# EAGLE board v.0.0.0 (EAGLE 5.08)
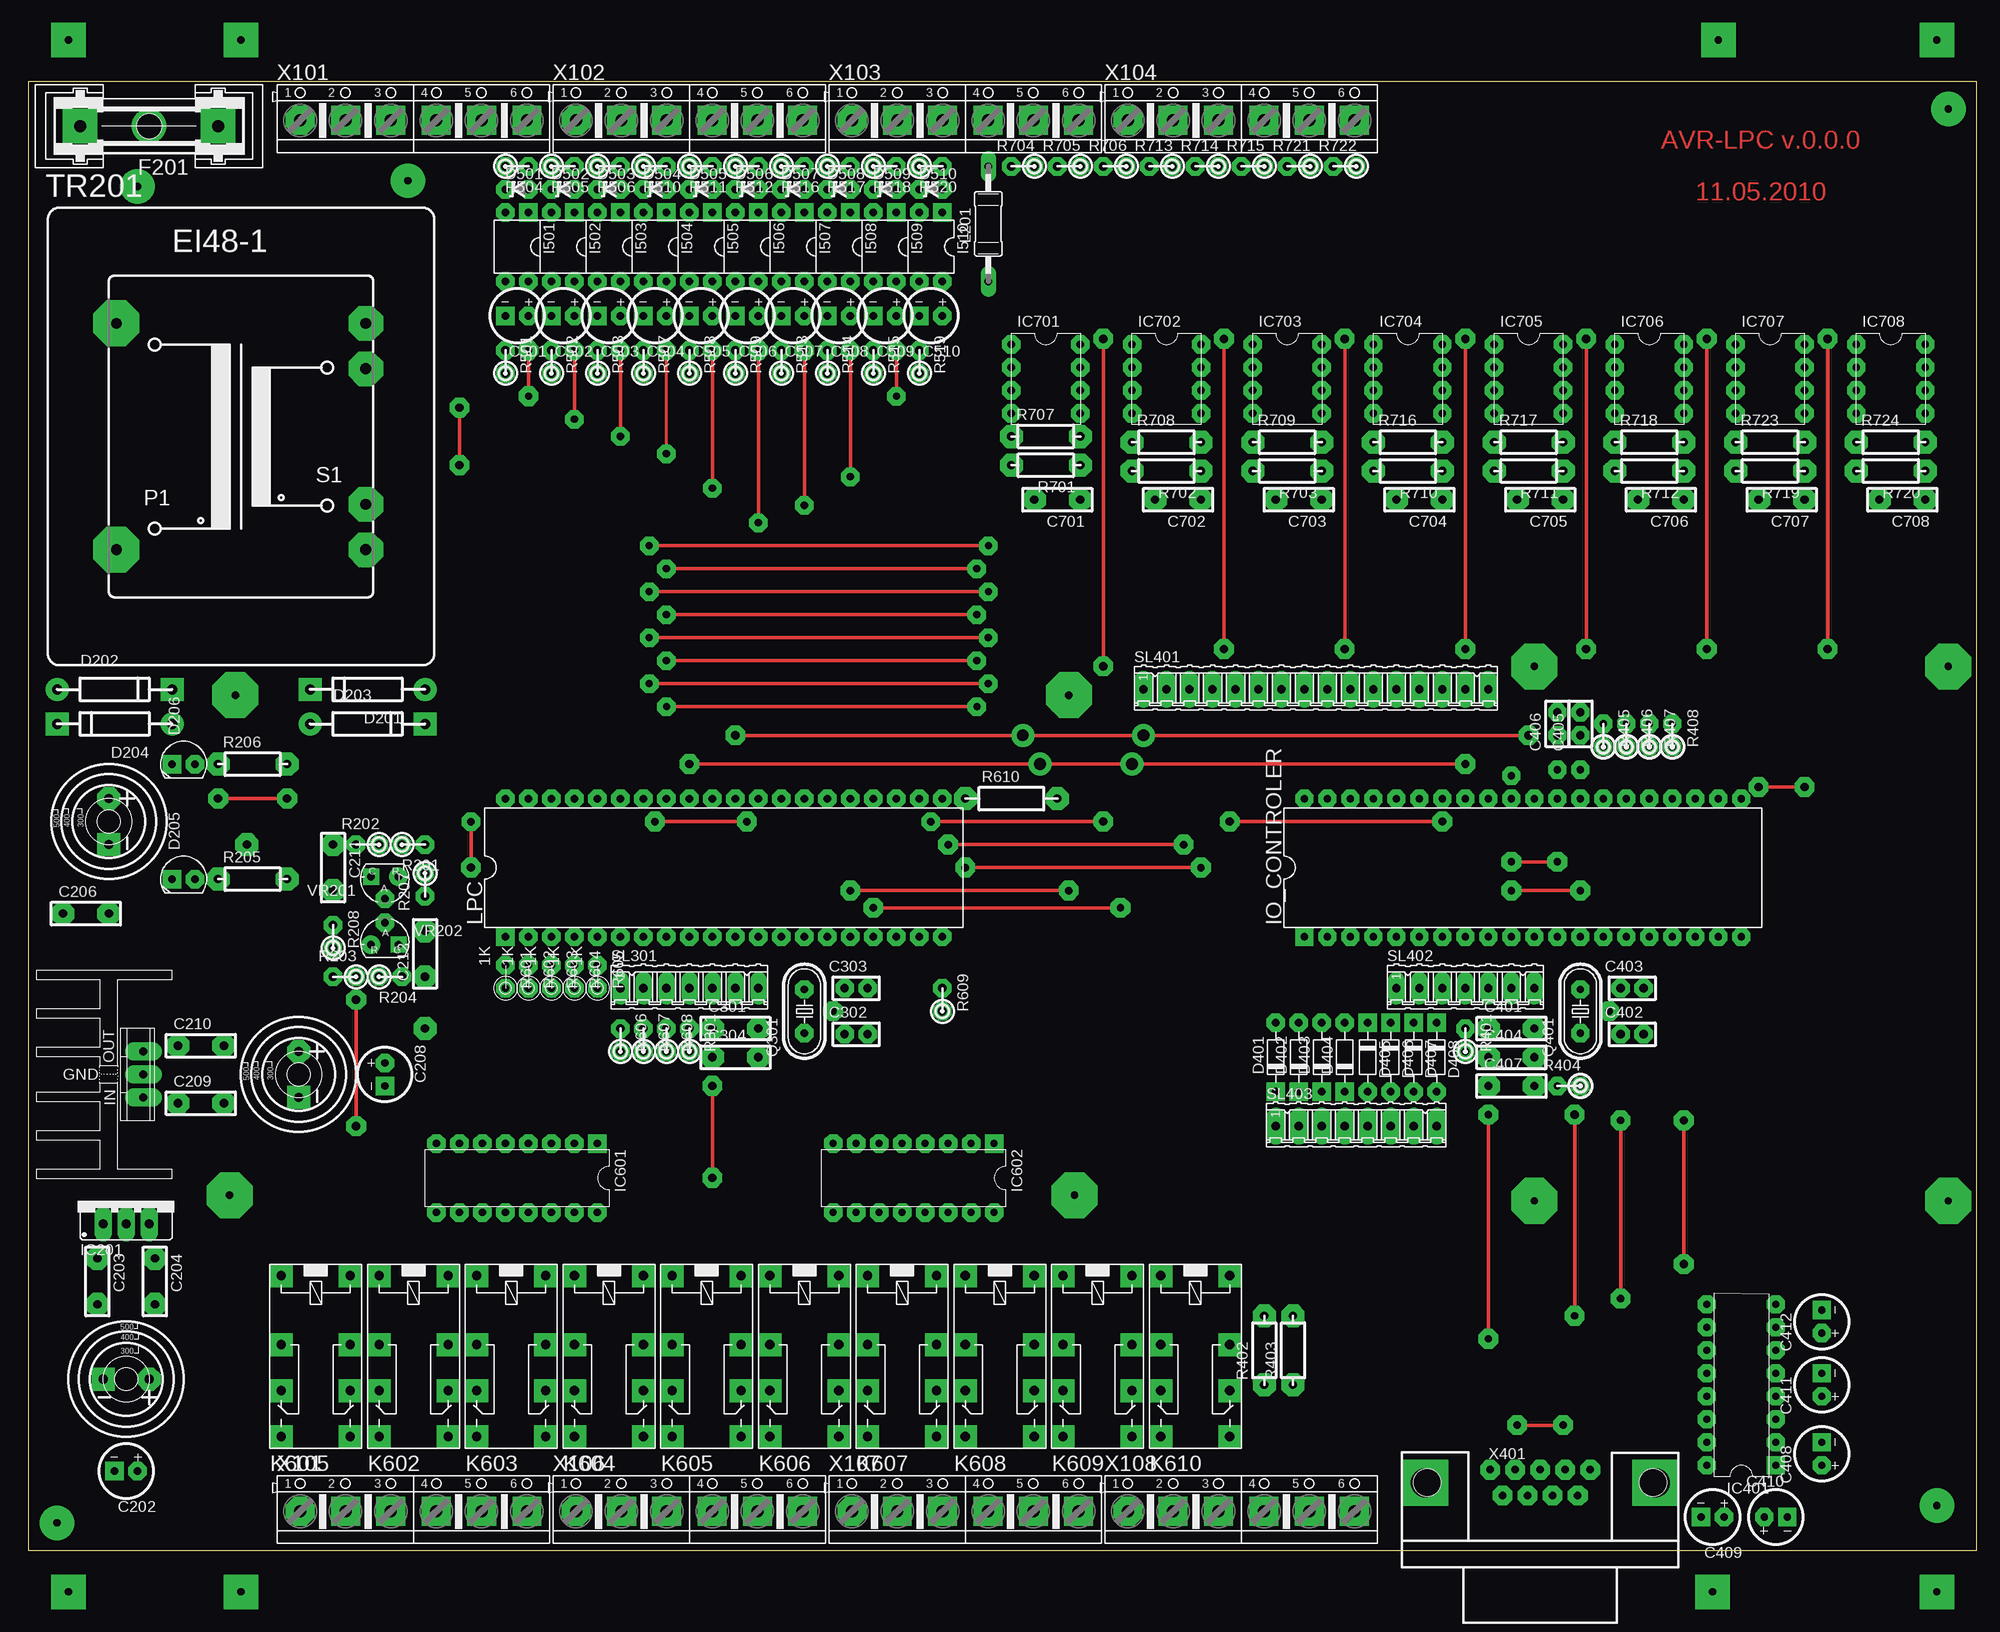
[diagram p7: board, top side]
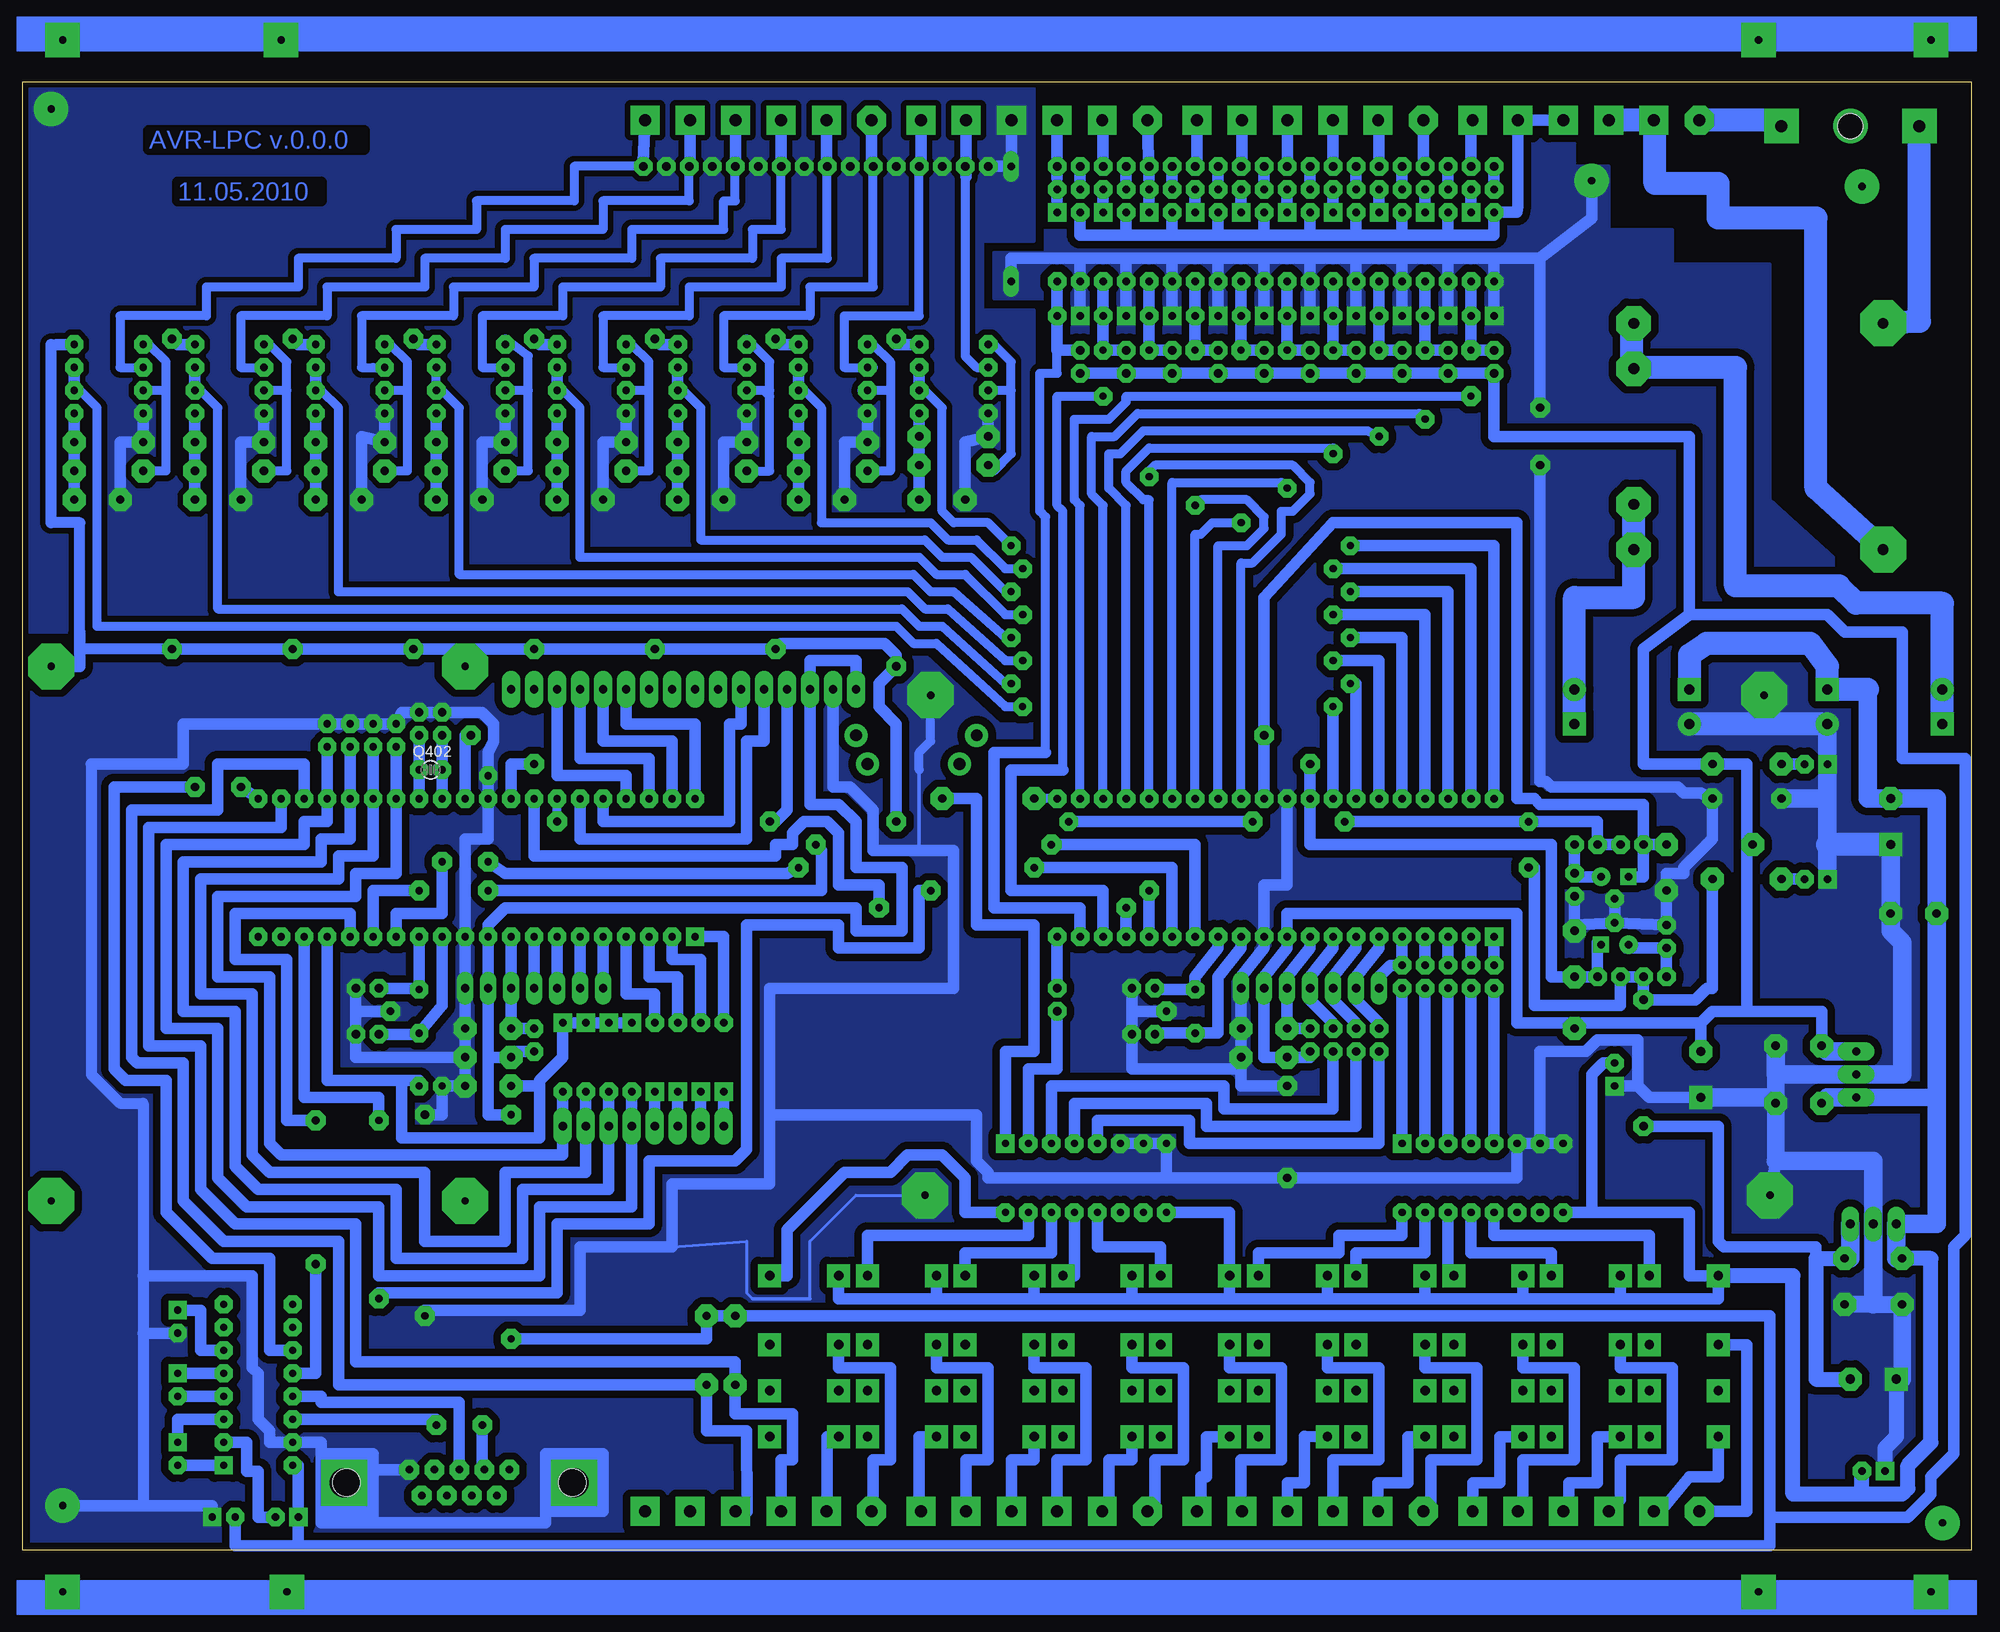
[diagram p8: board, bottom side, seen from below]

Size 215.25 x 162.23 mm. Coordinates in mm from the lower left corner, seen from the top.
Outline: 0,0 215.25,0 215.25,162.23 0,162.23 0,0
Copper layers (1*16): Top 0.035mm / dielectric 1.5mm / Bottom 0.035mm
Design rules "default *": minimum track width 50mil, minimum drill 31mil, track to track 25mil, track to pad 20mil, pad to pad 20mil, via to via 20mil, smd to smd 8mil, copper to edge 25mil, drill to drill 25mil, minimum pad ring 18mil, minimum via ring 8mil, stop-mask expansion 4mil, vias tented up to drill 0mil, thermal gap 10mil
bKeepout: 10 lines

## Footprints (pad centres in the part's own frame; a part is rotated, then mirrored left to right if it is on the bottom)
CP200X100X40 = drill 1.016 pad 2.54 octagon: + 2.54,0 | drill 1.016 pad 2.54 square: - -2.54,0
CP100X80X32 = drill 0.813 pad 2.032 octagon: + -1.27,0 | drill 0.813 pad 2.032 square: - 1.27,0
C200X100X36 = drill 0.914 pad 2.54 octagon: P$1 -2.54,0; P$2 2.54,0
C100X86X36 = drill 0.914 pad 2.032 octagon: P$1 -1.27,0; P$2 1.27,0
400X100 = drill 1.1 pad 2.54 round: A -6.35,0 | drill 1.1 pad 2.54 square: C 6.35,0
SFH205 = drill 0.813 pad 2.032 octagon: A 0,-1.27 | drill 0.813 pad 2.032 square: K 0,1.27
D-7.5 = drill 0.813 pad 2.032 octagon: A 3.81,0 | drill 0.813 pad 2.032 square: C -3.81,0
ZDIO-2.5 = drill 0.813 pad 2.032 octagon: A 1.27,0; C -1.27,0
GSH15 = drill 1.321 pad 3.81 square: 1 -7.62,0; 2 7.62,0 | drill 2 pad 3.81 round: P$1 0,0 | hole 2.794: 0,0
DIL04 = drill 0.813 pad 2.032 square: 1 -1.27,-3.81 | drill 0.813 pad 2.032 octagon: 2 1.27,-3.81; 3 1.27,3.81; 4 -1.27,3.81
78XXS = drill 1.016 long: GND 0,-2.54; IN -2.54,-2.54; OUT 2.54,-2.54
78XX_VERTICAL_COOLER = drill 0.9 pad 2.032 long: GND 0,-2.54; IN -2.54,-2.54; OUT 2.54,-2.54
DIL16 = drill 0.8 pad 2.032 square: 1 -8.89,-3.81 | drill 0.8 pad 2.032 octagon: 2 -6.35,-3.81; 3 -3.81,-3.81; 4 -1.27,-3.81; 5 1.27,-3.81; 6 3.81,-3.81; 7 6.35,-3.81; 8 8.89,-3.81; 9 8.89,3.81; 10 6.35,3.81; 11 3.81,3.81; 12 1.27,3.81; 13 -1.27,3.81; 14 -3.81,3.81; 15 -6.35,3.81; 16 -8.89,3.81
DIL8 = drill 0.8 pad 2.032 octagon: 1 -3.81,-3.81; 2 -1.27,-3.81; 3 1.27,-3.81; 4 3.81,-3.81; 5 3.81,3.81; 6 1.27,3.81; 7 -1.27,3.81; 8 -3.81,3.81
DIL40 = drill 0.813 pad 2.032 square: 1 -24.13,-7.62 | drill 0.813 pad 2.032 octagon: 2 -21.59,-7.62; 3 -19.05,-7.62; 4 -16.51,-7.62; 5 -13.97,-7.62; 6 -11.43,-7.62; 7 -8.89,-7.62; 8 -6.35,-7.62; 9 -3.81,-7.62; 10 -1.27,-7.62; 11 1.27,-7.62; 12 3.81,-7.62; 13 6.35,-7.62; 14 8.89,-7.62; 15 11.43,-7.62; 16 13.97,-7.62; 17 16.51,-7.62; 18 19.05,-7.62; 19 21.59,-7.62; 20 24.13,-7.62; 21 24.13,7.62; 22 21.59,7.62; 23 19.05,7.62; 24 16.51,7.62; 25 13.97,7.62; 26 11.43,7.62; 27 8.89,7.62; 28 6.35,7.62; 29 3.81,7.62; 30 1.27,7.62; 31 -1.27,7.62; 32 -3.81,7.62; 33 -6.35,7.62; 34 -8.89,7.62; 35 -11.43,7.62; 36 -13.97,7.62; 37 -16.51,7.62; 38 -19.05,7.62; 39 -21.59,7.62; 40 -24.13,7.62
351 = drill 1.016 pad 2.54 square: 1 -3.81,-3.81; 16 -3.81,3.81; O1 8.89,-3.81; O2 8.89,3.81; P1 3.81,-3.81; P2 3.81,3.81; S1 13.97,-3.81; S2 13.97,3.81
MICC12 = drill 0.813 long: 1 -6.35,0; 2 6.35,0
HC49U-V = drill 0.813 pad 2.032 octagon: 1 -2.413,0; 2 2.413,0
TC26V = drill 0.813 pad 2.032 octagon: 1 -1.27,0; 2 1.27,0
R100X86X36 = drill 0.914 pad 2.032 octagon: P$1 -1.27,0; P$2 1.27,0
R300X100X36 = drill 0.914 pad 2.54 octagon: P$1 -3.81,0; P$2 3.81,0
R100X80X32 = drill 0.813 pad 2.032 octagon: P$1 -1.27,0; P$2 1.27,0
R100X80 = drill 0.8 pad 2.032 octagon: P$1 -1.27,0; P$2 1.27,0
R400X100X36 = drill 0.914 pad 2.54 octagon: P$1 -5.08,0; P$2 5.08,0
07P = drill 0.914 long: 1 -7.62,0; 2 -5.08,0; 3 -2.54,0; 4 0,0; 5 2.54,0; 6 5.08,0; 7 7.62,0
16P = drill 0.914 pad 2.032 long: 1 -19.05,0; 2 -16.51,0; 3 -13.97,0; 4 -11.43,0; 5 -8.89,0; 6 -6.35,0; 7 -3.81,0; 8 -1.27,0; 9 1.27,0; 10 3.81,0; 11 6.35,0; 12 8.89,0; 13 11.43,0; 14 13.97,0; 15 16.51,0; 16 19.05,0
08P = drill 0.914 pad 2.032 long: 1 -8.89,0; 2 -6.35,0; 3 -3.81,0; 4 -1.27,0; 5 1.27,0; 6 3.81,0; 7 6.35,0; 8 8.89,0
EI48-1 = drill 1.194 pad 5.08 octagon: 1 -13.767,12.497; 6 -13.767,-12.497 | drill 1.194 pad 3.81 octagon: 7 13.767,-12.497; 8 13.767,-7.493; 11 13.767,7.493; 12 13.767,12.497
TO92-CLP = drill 0.813 pad 2.032 octagon: A 0,2.159 | drill 0.813 pad 1.778 square: C 1.524,-0.254 | drill 0.813 pad 2.032 round: R -1.524,-0.254
AK500/6 = drill 1.321 pad 3.2 octagon: 1 -12.522,0 | drill 1.321 pad 3.2 square: 2 -7.518,0; 3 -2.515,0; 4 2.515,0; 5 7.518,0; 6 12.522,0
H5M09RA = drill 0.813 pad 2.184 octagon: 1 -5.537,1.422; 2 -2.769,1.422; 3 0,1.422; 4 2.769,1.422; 5 5.537,1.422; 6 -4.153,-1.422; 7 -1.384,-1.422; 8 1.384,-1.422; 9 4.153,-1.422 | drill 3.2 pad 5.08 square: P$1 -12.7,0; P$2 12.7,0 | hole 3.048: -12.497,0; 12.497,0

## Placement (x,y rotation side)
C201  2200uF/16V  [CP200X100X40]  10.79,18.89 0 top
C202  250uF/25V  [CP100X80X32]  10.79,8.73 180 top
C203  100nF/63V  [C200X100X36]  7.62,29.68 270 top
C204  100nF/63V  [C200X100X36]  13.96,29.68 270 top
C205  2200uF/25V  [CP200X100X40]  8.88,80.48 90 top
C206  100nF/63V  [C200X100X36]  6.34,70.32 0 top
C207  2200uF/10V  [CP200X100X40]  29.84,52.54 90 top
C208  250uF/25V  [CP100X80X32]  39.36,52.54 270 top
C209  100nF/63V  [C200X100X36]  19.05,49.37 0 top
C210  100nF/63V  [C200X100X36]  19.05,55.72 0 top
C211  100nF/63V  [C200X100X36]  33.65,75.4 270 top
C212  100nF/63V  [C200X100X36]  43.81,65.88 90 top
C301  100nF/63V  [C200X100X36]  78.1,57.62 0 top
C302  27pF  [C100X86X36]  91.44,56.98 0 top
C303  27pF  [C100X86X36]  91.44,62.06 0 top
C304  100nF/63V  [C200X100X36]  78.1,54.45 0 top
C401  100nF/63V  [C200X100X36]  163.83,57.62 0 top
C402  27pF  [C100X86X36]  177.16,56.98 0 top
C403  27pF  [C100X86X36]  177.16,62.06 0 top
C404  100nF/63V  [C200X100X36]  163.83,54.45 0 top
C405  27pF  [C100X86X36]  171.44,91.27 90 top
C406  27pF  [C100X86X36]  168.91,91.27 90 top
C407  100nF/63V  [C200X100X36]  163.83,51.27 0 top
C408  1uF/16V  [CP100X80X32]  198.12,10.63 90 top
C409  1uF/16V  [CP100X80X32]  186.05,3.65 180 top
C410  1uF/16V  [CP100X80X32]  193.03,3.65 0 top
C411  1uF/16V  [CP100X80X32]  198.12,18.25 90 top
C412  1uF/16V  [CP100X80X32]  198.12,25.23 90 top
C501  4.7uF/6V  [CP100X80X32]  53.97,136.36 180 top
C502  4.7uF/6V  [CP100X80X32]  59.05,136.36 180 top
C503  4.7uF/6V  [CP100X80X32]  64.13,136.36 180 top
C504  4.7uF/6V  [CP100X80X32]  69.21,136.36 180 top
C505  4.7uF/6V  [CP100X80X32]  74.29,136.36 180 top
C506  4.7uF/6V  [CP100X80X32]  79.37,136.36 180 top
C507  4.7uF/6V  [CP100X80X32]  84.45,136.36 180 top
C508  4.7uF/6V  [CP100X80X32]  89.53,136.36 180 top
C509  4.7uF/6V  [CP100X80X32]  94.61,136.36 180 top
C510  4.7uF/6V  [CP100X80X32]  99.69,136.36 180 top
C701  100nF/63V  [C200X100X36]  113.66,116.04 180 top
C702  100nF/63V  [C200X100X36]  127,116.04 180 top
C703  100nF/63V  [C200X100X36]  140.33,116.04 180 top
C704  100nF/63V  [C200X100X36]  153.66,116.04 180 top
C705  100nF/63V  [C200X100X36]  167,116.04 180 top
C706  100nF/63V  [C200X100X36]  180.34,116.04 180 top
C707  100nF/63V  [C200X100X36]  193.67,116.04 180 top
C708  100nF/63V  [C200X100X36]  207,116.04 180 top
D201  1N4007  [400X100]  37.46,95.08 180 top
D202  1N4007  [400X100]  9.52,95.08 0 top
D203  1N4007  [400X100]  37.46,91.27 0 top
D204  1N4007  [400X100]  9.52,91.27 180 top
D205  SFH205  [SFH205]  17.14,74.13 90 top
D206  SFH205  [SFH205]  17.14,86.83 90 top
D401  1N4007  [D-7.5]  137.79,54.45 90 top
D402  1N4007  [D-7.5]  140.33,54.45 90 top
D403  1N4007  [D-7.5]  142.87,54.45 90 top
D404  1N4007  [D-7.5]  145.41,54.45 90 top
D405  1N4007  [D-7.5]  147.95,54.45 270 top
D406  1N4007  [D-7.5]  150.49,54.45 270 top
D407  1N4007  [D-7.5]  153.03,54.45 270 top
D408  1N4007  [D-7.5]  155.57,54.45 270 top
D501  5.7V  [ZDIO-2.5]  53.97,150.33 0 top
D502  5.7V  [ZDIO-2.5]  59.05,150.33 0 top
D503  5.7V  [ZDIO-2.5]  64.13,150.33 0 top
D504  5.7V  [ZDIO-2.5]  69.21,150.33 0 top
D505  5.7V  [ZDIO-2.5]  74.29,150.33 0 top
D506  5.7V  [ZDIO-2.5]  79.37,150.33 0 top
D507  5.7V  [ZDIO-2.5]  84.45,150.33 0 top
D508  5.7V  [ZDIO-2.5]  89.53,150.33 0 top
D509  5.7V  [ZDIO-2.5]  94.61,150.33 0 top
D510  5.7V  [ZDIO-2.5]  99.69,150.33 0 top
F201  250V/10mA  [GSH15]  13.33,157.31 180 top
I501  PC814  [DIL04]  53.97,143.98 180 top
I502  PC814  [DIL04]  59.05,143.98 180 top
I503  PC814  [DIL04]  64.13,143.98 180 top
I504  PC814  [DIL04]  69.21,143.98 180 top
I505  PC814  [DIL04]  74.29,143.98 180 top
I506  PC814  [DIL04]  79.37,143.98 180 top
I507  PC814  [DIL04]  84.45,143.98 180 top
I508  PC814  [DIL04]  89.53,143.98 180 top
I509  PC814  [DIL04]  94.61,143.98 180 top
I510  PC814  [DIL04]  99.69,143.98 180 top
IC201  LM7812  [78XXS]  10.79,38.57 0 top
IC202  LM7805  [78XX_VERTICAL_COOLER]  10.15,52.54 90 top
IC401  MAX232  [DIL16]  189.22,18.25 90 top
IC601  ULN2003A  [DIL16]  53.97,41.11 180 top
IC602  ULN2003A  [DIL16]  97.79,41.11 180 top
IC701  LM358MN  [DIL8]  112.39,129.38 270 top
IC702  LM358MN  [DIL8]  125.73,129.38 270 top
IC703  LM358MN  [DIL8]  139.06,129.38 270 top
IC704  LM358MN  [DIL8]  152.4,129.38 270 top
IC705  LM358MN  [DIL8]  165.73,129.38 270 top
IC706  LM358MN  [DIL8]  179.06,129.38 270 top
IC707  LM358MN  [DIL8]  192.4,129.38 270 top
IC708  LM358MN  [DIL8]  205.74,129.38 270 top
IO_CONTROLER  MEGA32-P  [DIL40]  165.09,75.4 0 top
K601  351  [351]  31.75,26.51 270 top
K602  351  [351]  42.54,26.51 270 top
K603  351  [351]  53.34,26.51 270 top
K604  351  [351]  64.13,26.51 270 top
K605  351  [351]  74.93,26.51 270 top
K606  351  [351]  85.72,26.51 270 top
K607  351  [351]  96.52,26.51 270 top
K608  351  [351]  107.31,26.51 270 top
K609  351  [351]  118.11,26.51 270 top
K610  351  [351]  128.9,26.51 270 top
L201  1mH*  [MICC12]  106.04,146.52 90 top
LPC  MEGA32-P  [DIL40]  76.83,75.4 0 top
Q301  16MHz  [HC49U-V]  85.72,59.52 90 top
Q401  16MHz  [HC49U-V]  171.44,59.52 90 top
Q402  38.768KHz  [TC26V]  170.18,86.19 0 bottom
R201  *  [R100X86X36]  42.54,77.94 180 top
R202  *  [R100X86X36]  37.46,77.94 0 top
R203  *  [R100X86X36]  34.92,63.34 0 top
R204  *  [R100X86X36]  40,63.34 180 top
R205  1K  [R300X100X36]  24.76,74.13 0 top
R206  330  [R300X100X36]  24.76,86.83 0 top
R207  *  [R100X86X36]  43.81,73.49 90 top
R208  *  [R100X86X36]  33.65,67.78 270 top
R301  10K  [R100X86X36]  73.02,56.35 270 top
R401  10K  [R100X86X36]  158.75,56.35 270 top
R402  *  [R300X100X36]  136.52,22.06 90 top
R403  *  [R300X100X36]  139.69,22.06 90 top
R404  4.7K  [R100X80X32]  170.18,51.27 0 top
R405  10K  [R100X80X32]  173.99,90 270 top
R406  10K  [R100X80X32]  176.53,90 270 top
R407  10K  [R100X80X32]  179.06,90 270 top
R408  10K  [R100X80X32]  181.61,90 270 top
R501  1K  [R100X86X36]  52.7,131.28 270 top
R502  1K  [R100X86X36]  57.78,131.28 270 top
R503  1K  [R100X86X36]  62.86,131.28 270 top
R504  1.3K  [R100X86X36]  53.97,152.87 180 top
R505  1.3K  [R100X86X36]  59.05,152.87 180 top
R506  1.3K  [R100X86X36]  64.13,152.87 180 top
R507  1K  [R100X86X36]  67.94,131.28 270 top
R508  1K  [R100X86X36]  73.02,131.28 270 top
R509  1K  [R100X86X36]  78.1,131.28 270 top
R510  1.3K  [R100X86X36]  69.21,152.87 180 top
R511  1.3K  [R100X86X36]  74.29,152.87 180 top
R512  1.3K  [R100X86X36]  79.37,152.87 180 top
R513  1K  [R100X86X36]  83.18,131.28 270 top
R514  1K  [R100X86X36]  88.26,131.28 270 top
R515  1K  [R100X86X36]  93.34,131.28 270 top
R516  1.3K  [R100X86X36]  84.45,152.87 180 top
R517  1.3K  [R100X86X36]  89.53,152.87 180 top
R518  1.3K  [R100X86X36]  94.61,152.87 180 top
R519  1K  [R100X86X36]  98.42,131.28 270 top
R520  1.3K  [R100X86X36]  99.69,152.87 180 top
R601  1K  [R100X80]  52.7,63.34 270 top
R602  1K  [R100X80]  55.24,63.34 270 top
R603  1K  [R100X80]  57.78,63.34 270 top
R604  1K  [R100X80]  60.32,63.34 270 top
R605  1K  [R100X80]  62.86,63.34 270 top
R606  1K  [R100X86X36]  65.4,56.35 270 top
R607  1K  [R100X86X36]  67.94,56.35 270 top
R608  1K  [R100X86X36]  70.48,56.35 270 top
R609  1K  [R100X86X36]  100.96,60.8 270 top
R610  1K  [R400X100X36]  108.58,83.02 0 top
R701  51K  [R300X100X36]  112.39,119.85 180 top
R702  51K  [R300X100X36]  125.73,119.21 180 top
R703  51K  [R300X100X36]  139.06,119.21 180 top
R704  500  [R100X86X36]  109.85,152.87 0 top
R705  500  [R100X86X36]  114.93,152.87 0 top
R706  500  [R100X86X36]  120.01,152.87 0 top
R707  51K  [R300X100X36]  112.39,123.02 0 top
R708  51K  [R300X100X36]  125.73,122.39 0 top
R709  51K  [R300X100X36]  139.06,122.39 0 top
R710  51K  [R300X100X36]  152.4,119.21 180 top
R711  51K  [R300X100X36]  165.73,119.21 180 top
R712  51K  [R300X100X36]  179.06,119.21 180 top
R713  500  [R100X86X36]  125.09,152.87 0 top
R714  500  [R100X86X36]  130.17,152.87 0 top
R715  500  [R100X86X36]  135.25,152.87 0 top
R716  51K  [R300X100X36]  152.4,122.39 0 top
R717  51K  [R300X100X36]  165.73,122.39 0 top
R718  51K  [R300X100X36]  179.06,122.39 0 top
R719  51K  [R300X100X36]  192.4,119.21 180 top
R720  51K  [R300X100X36]  205.74,119.21 180 top
R721  500  [R100X86X36]  140.33,152.87 0 top
R722  500  [R100X86X36]  145.41,152.87 0 top
R723  51K  [R300X100X36]  192.4,122.39 0 top
R724  51K  [R300X100X36]  205.74,122.39 0 top
SL301  [07P]  73.02,62.06 0 top
SL401  JM204A  [16P]  142.24,95.08 0 top
SL402  ISP2  [07P]  158.75,62.06 0 top
SL403  KEY BOARD  [08P]  146.68,46.83 0 top
TR201  [EI48-1]  23.49,123.02 0 top
VR201  TL431  [TO92-CLP]  39.36,74.13 180 top
VR202  [TO92-CLP]  39.36,67.14 0 top
X101  [AK500/6]  42.54,157.95 0 top
X102  [AK500/6]  73.02,157.95 0 top
X103  [AK500/6]  103.5,157.95 0 top
X104  [AK500/6]  133.98,157.95 0 top
X105  [AK500/6]  42.54,4.28 0 top
X106  [AK500/6]  73.02,4.28 0 top
X107  [AK500/6]  103.5,4.28 0 top
X108  [AK500/6]  133.98,4.28 0 top
X401  D-SUB9-H5M09RA  [H5M09RA]  167,7.46 0 top

## Tracks (layer width: path | path; a pad name or v marks a point on that pad's centre or on a via)
+5V  (via drill 0.81 pad 2.18, 0.91 pad 2.54)
  Top 0.381: v161.28,23.33 v161.28,48.09
  Bottom 1.27: R501.P$2 R502.P$2 R503.P$2 R507.P$2 R508.P$2 R509.P$2 R513.P$2 R514.P$2 R515.P$2 R519.P$2 R501.P$2 | R301.P$2 73.02,54.45 C304.P$1 78.1,54.45 SL301.6 78.1,63.34 75.56,66.51 LPC.10 75.56,70.32 50.16,70.32 50.16,58.26 43.81,58.26 | 29.84,58.26 C207.+ | SL401.1 123.19,98.26 128.27,98.26 SL401.3 128.27,82.38 125.09,82.38 123.19,80.48 123.19,75.4 118.11,75.4 118.11,68.41 123.19,68.41 123.19,70.95 161.92,70.95 163.83,69.05 IO_CONTROLER.10 SL402.6 163.83,54.45 | R501.P$2 52.7,123.02 31.11,123.02 31.11,103.34 | 24.76,77.94 24.76,59.52 | 22.22,3.65 22.22,0.47 184.78,0.47 | 22.22,3.65 22.22,25.87 R402.P$2 R403.P$2 139.69,23.33 v161.28,23.33 | 31.11,103.34 36.19,99.53 36.19,86.83 R206.P$2 24.76,86.83 24.76,77.94 | 31.11,103.34 15.87,103.34 13.96,101.43 7.62,101.43 7.62,87.46 0.63,87.46 0.63,34.76 1.9,33.49 1.9,10.63 4.44,8.09 4.44,6.18 6.98,3.65 22.22,3.65 | v161.28,48.09 163.83,48.09 163.83,54.45 | 163.83,54.45 C404.P$1 161.28,55.08 R401.P$2 | 184.78,0.47 191.77,0.47 C410.+ | 43.81,58.26 v43.81,57.62 | 24.76,77.94 v24.12,77.94 | 184.78,0.47 C409.- 184.78,9.36 IC401.16 | 29.84,58.26 43.81,58.26 | 29.84,58.26 28.57,59.52 24.76,59.52 | 24.76,59.52 16.51,59.52 C210.P$1
  Bottom 2.032: IC202.OUT 15.87,55.08 C210.P$1
+12V  (via drill 0.81 pad 2.03, 0.81 pad 2.18, 0.81 pad 5.08, 0.91 pad 2.18)
  Top 0.381: v118.74,97.62 v118.74,133.82 | v132.08,99.53 v132.08,133.82 | v145.41,99.53 v145.41,133.82 | v158.75,99.53 v158.75,133.82 | v172.08,99.53 v172.08,133.82 | v185.41,99.53 v185.41,133.82 | v198.75,99.53 v198.75,133.82 | v36.19,60.8 v36.19,46.83 | v48.89,80.48 v48.89,75.4 | v118.74,80.48 v99.69,80.48 | v79.37,80.48 v69.21,80.48
  Bottom 1.016: 166.37,99.53 v166.37,97.62
  Bottom 1.24: v198.75,99.53 208.91,99.53 | IC708.8 212.09,133.19 212.09,113.5 208.91,113.5 208.91,101.43
  Bottom 1.27: IC702.8 131.44,133.19 v132.08,133.82 | IC701.8 118.74,133.19 v118.74,133.82 | IC703.8 144.78,133.19 v145.41,133.82 | IC704.8 158.11,133.19 v158.75,133.82 | IC705.8 171.44,133.19 v172.08,133.82 | IC706.8 184.78,133.19 v185.41,133.82 | IC707.8 198.12,133.19 v198.75,133.82 | v198.75,99.53 v185.41,99.53 v172.08,99.53 166.37,99.53 v158.75,99.53 v145.41,99.53 v132.08,99.53 131.44,100.16 120.01,100.16 118.74,98.89 v118.74,97.62 120.65,95.72 120.65,93.18 118.74,91.27 v118.74,80.48 | IC708.8 211.45,133.19 | v36.19,46.83 27.94,46.83 27.94,34.12 27.3,33.49 17.14,33.49 17.14,32.22 | v48.89,75.4 48.25,75.4 48.25,60.16 38.73,60.16 R204.P$2 R203.P$2 v36.19,60.8 30.48,60.8 29.21,62.06 28.57,62.06 R205.P$2 | v69.21,80.48 v48.89,80.48 41.27,80.48 R201.P$2 R202.P$2 | v99.69,80.48 v79.37,80.48 | 208.91,101.43 208.91,99.53 208.91,97.62 v212.09,97.62
  Bottom 1.676: C204.P$1 17.14,32.22 17.14,18.89 C201.+
  Bottom 2.032: IC201.OUT 13.33,32.22 C204.P$1
+15V
  Bottom 1.27: K610.1 125.09,27.78 114.3,27.78 | 38.73,27.78 49.52,27.78 | 49.52,27.78 60.32,27.78 | 60.32,27.78 71.12,27.78 | 71.12,27.78 81.91,27.78 | 81.91,27.78 92.7,27.78 | 92.7,27.78 103.5,27.78 | 103.5,27.78 114.3,27.78 | 38.73,27.78 K602.1 | 49.52,27.78 K603.1 | 60.32,27.78 K604.1 | 71.12,27.78 K605.1 | 81.91,27.78 K606.1 81.91,37.3 IC602.9 | 92.7,27.78 K607.1 | 103.5,27.78 K608.1 | 114.3,27.78 K609.1 | 38.73,27.78 27.94,27.78 K601.1 31.11,30.32 31.11,37.3 41.9,37.3 | 41.9,37.3 IC601.9 | 41.9,37.3 41.9,52.54 40.63,53.81 C208.+
  Bottom 1.676: 8.25,32.22 4.44,32.22 4.44,11.9 6.98,9.36 6.98,6.82 7.62,6.18 12.06,6.18 | 12.06,6.18 C202.+ | K601.1 19.68,30.32 19.68,6.18 12.06,6.18
  Bottom 1.905: 8.25,32.22 C203.P$1
  Bottom 1.93: 3.81,50 IC202.IN
  Bottom 2.032: 8.25,32.22 IC201.IN 3.81,36.03 3.81,50 C206.P$1 3.81,83.02 C205.+ 11.42,83.02 11.42,95.08 | IC202.IN 15.87,50 C209.P$1
  Bottom 2.54: 11.42,95.08 D202.C 15.87,97.62 17.78,100.16 29.21,100.16 31.11,98.89 D201.C
AGND  (via drill 0.81 pad 3.81)
  Bottom 1.27: X103.4 106.03,152.87 L201.2 R704.P$1 | IC702.4 R708.P$1 124.45,122.39 C702.P$2 | C708.P$2 204.47,122.39 R724.P$1 IC708.4 | C706.P$2 177.8,123.02 R718.P$1 IC706.4 | IC701.4 R707.P$1 111.12,122.39 C701.P$2 | IC703.4 R709.P$1 137.79,122.39 C703.P$2 | C704.P$2 151.12,122.39 R716.P$1 IC704.4 | IC705.4 R717.P$1 164.46,122.39 C705.P$2 | C707.P$2 191.13,122.39 R723.P$1 IC707.4
  other vias: 212.09,159.22
  pour Bottom (no thermals): 103.5,93.18 103.5,137 109.22,137 109.22,144.62 103.5,144.62 103.5,161.76 215.26,161.76 214.62,101.43 115.56,101.43 107.31,93.18
AI0
  Bottom 1.016: IC701.2 109.85,130.65 111.12,131.92 R704.P$2
  Bottom 1.27: X103.5 111.02,151.7 R704.P$2
AI1
  Bottom 1.016: 121.28,130.65 IC702.2 124.45,130.65 124.45,136.36 116.2,136.36 R705.P$2
  Bottom 1.27: X103.6 116.02,153.05 R705.P$2
AI2
  Bottom 1.016: R706.P$2 121.28,139.53 128.27,139.53 128.27,136.36 137.79,136.36 137.79,130.65 IC703.2
  Bottom 1.27: X104.1 121.46,153.05 R706.P$2
AI3
  Bottom 1.016: 126.46,152.97 126.36,157.95 126.36,142.71 131.44,142.71 131.44,139.53 141.6,139.53 141.6,136.36 151.12,136.36 151.12,130.65 IC704.2
  Bottom 1.27: X104.2 126.46,152.97 R713.P$2
AI4
  Bottom 1.016: 131.47,152.9 131.47,147.18 131.44,145.89 134.62,145.89 134.62,142.71 144.78,142.71 144.78,139.53 155.57,139.53 155.57,136.36 164.46,136.36 164.46,130.65 IC705.2
  Bottom 1.27: X104.3 131.47,152.9 R714.P$2
AI5
  Bottom 1.016: IC706.2 176.53,130.65 177.8,130.65 177.8,136.36 167.63,136.36 167.63,139.53 158.75,139.53 158.75,142.71 147.95,142.71 147.95,145.89 137.79,145.89 137.79,149.06 136.52,149.06 R715.P$2
  Bottom 1.27: X104.4 136.5,152.9 R715.P$2
AI6
  Bottom 1.016: IC707.2 191.13,130.65 191.13,136.36 181.61,136.36 181.61,139.53 170.81,139.53 170.81,142.71 161.92,142.71 161.92,145.89 151.12,145.89 151.12,149.06 141.6,149.06 R721.P$2
  Bottom 1.27: X104.5 141.5,152.97 R721.P$2
AI7
  Bottom 1.016: IC708.2 204.47,130.65 204.47,136.36 194.94,136.36 194.94,139.53 184.78,139.53 184.78,142.71 173.99,142.71 173.99,145.89 165.09,145.89 165.09,149.06 154.3,149.06 154.3,152.87 R722.P$2
  Bottom 1.27: R722.P$2 146.68,153.33 X104.6
AIN_PUT0  (via drill 0.79 pad 2.03)
  Top 0.381: v68.58,110.96 v106.04,110.96
  Bottom 1.016: IC701.6 115.56,128.11 113.66,126.2 113.66,114.77 112.39,113.5 108.58,113.5 v106.04,110.96
  Bottom 1.27: IC701.6 IC701.7 | LPC.40 52.7,110.96 v68.58,110.96
AIN_PUT1  (via drill 0.8 pad 2.03)
  Top 0.406: v104.77,108.42 v70.48,108.42
  Bottom 1.016: v104.77,108.42 106.68,108.42 109.85,111.59 113.03,111.59 114.93,113.5 127,113.5 127,126.2 129.53,128.74
  Bottom 1.27: IC702.6 129.53,128.74 IC702.7 | LPC.39 55.24,108.42 v70.48,108.42
AIN_PUT2  (via drill 0.79 pad 2.03)
  Top 0.381: v106.04,105.88 v68.58,105.88
  Bottom 1.016: 142.87,128.74 140.33,126.2 140.33,111.59 115.56,111.59 113.66,109.69 110.48,109.69 106.68,105.88 v106.04,105.88
  Bottom 1.27: IC703.6 142.87,128.74 IC703.7 | v68.58,105.88 57.78,105.88 LPC.38
AIN_PUT3  (via drill 0.8 pad 2.03)
  Top 0.406: v104.77,103.34 v70.48,103.34
  Bottom 1.016: 156.21,128.74 153.66,126.2 153.66,109.69 116.2,109.69 114.3,107.78 111.12,107.78 106.68,103.34 v104.77,103.34
  Bottom 1.27: IC704.6 156.21,128.74 IC704.7 | LPC.37 60.32,103.34 v70.48,103.34
AIN_PUT4  (via drill 0.8 pad 2.03)
  Top 0.406: v106.04,100.8 v68.58,100.8
  Bottom 1.016: v106.04,100.8 106.68,100.8 112.39,105.88 114.93,105.88 116.84,107.78 167,107.78 167,126.2 169.54,128.74 IC705.6 IC705.7
  Bottom 1.27: v68.58,100.8 62.86,100.8 LPC.36
AIN_PUT5  (via drill 0.8 pad 2.03)
  Top 0.406: v104.77,98.26 v70.48,98.26
  Bottom 1.016: IC706.6 182.24,128.11 180.34,126.2 180.34,105.88 117.47,105.88 115.56,103.97 113.03,103.97 106.68,98.26 v104.77,98.26
  Bottom 1.27: IC706.6 IC706.7 | LPC.35 65.4,98.26 v70.48,98.26
AIN_PUT6  (via drill 0.8 pad 2.03)
  Top 0.406: v106.04,95.72 v68.58,95.72
  Bottom 1.016: 196.21,128.74 193.67,126.2 193.67,103.97 118.11,103.97 116.2,102.07 113.66,102.07 106.68,95.72 v106.04,95.72
  Bottom 1.27: IC707.6 196.21,128.74 IC707.7 | v68.58,95.72 67.94,95.72 LPC.34
AIN_PUT7  (via drill 0.79 pad 2.03)
  Top 0.381: v104.77,93.18 v70.48,93.18
  Bottom 1.016: 209.55,128.74 207,126.2 207,102.07 118.74,102.07 116.84,100.16 114.3,100.16 106.68,93.18 v104.77,93.18
  Bottom 1.27: IC708.6 209.55,128.74 IC708.7 | v70.48,93.18 LPC.33
AREF  (via drill 0.91 pad 2.18, 1.3 pad 2.54)
  Top 0.381: v73.02,86.83 v111.76,86.83 v121.92,86.83 v158.75,86.83
  Bottom 1.27: v73.02,86.83 LPC.32 73.02,77.94 46.35,77.94 46.35,63.34 C212.P$1 R204.P$1 41.27,67.14 40.89,67.14 VR202.C | v158.75,86.83 161.28,86.83 IO_CONTROLER.32
AVCC  (via drill 0.91 pad 2.18, 1.3 pad 2.54)
  Top 0.381: v165.73,90 v123.19,90 v109.85,90 v78.1,90
  Bottom 1.27: R202.P$1 C211.P$1 | LPC.30 v78.1,90 78.1,105.24 70.48,113.5 50.16,113.5 50.16,83.02 48.25,83.02 47.62,82.38 36.19,82.38 R202.P$1 | v165.73,90 166.37,90 IO_CONTROLER.30 | VR201.C 36.19,74.38 R202.P$1
COL0
  Bottom 1.27: D401.A 137.79,67.78 IO_CONTROLER.1
COL1
  Bottom 1.27: D402.A 140.33,65.24 143.5,65.24 IO_CONTROLER.2
COL2
  Bottom 1.27: D403.A 142.87,63.34 146.05,63.34 IO_CONTROLER.3
COL3
  Bottom 1.27: D404.A 145.41,61.43 148.59,61.43 IO_CONTROLER.4
DATA0
  Bottom 1.27: IO_CONTROLER.40 140.97,91.27 148.59,91.27 SL401.11
DATA1
  Bottom 1.27: SL401.12 151.12,89.37 143.5,89.37 IO_CONTROLER.39
DATA2
  Bottom 1.27: SL401.13 153.66,87.46 146.05,87.46 IO_CONTROLER.38
DATA3
  Bottom 1.27: IO_CONTROLER.37 148.59,85.56 156.21,85.56 SL401.14
EN
  Bottom 1.27: IO_CONTROLER.36 151.12,80.48 137.16,80.48 137.16,91.27 135.88,91.27 SL401.6
GND  (via drill 0.8 pad 2.18, 0.81 pad 2.03, 0.81 pad 2.18, 0.81 pad 3.81, 0.81 pad 5.08, 0.91 pad 2.18)
  Top 0.381: v75.56,41.11 v75.56,51.27 | v170.81,48.09 v170.81,25.87 | v20.95,83.02 v28.57,83.02 | v47.62,119.85 v47.62,126.2
  Bottom 0.305: v115.56,39.2 123.19,39.2 128.27,34.12 128.27,27.78 | 134.62,27.78 135.25,28.41 135.25,34.12 143.5,33.49
  Bottom 0.381: 134.62,27.78 128.27,27.78
  Bottom 0.406: 116.2,77.3 116.2,86.19 | 116.2,77.3 117.47,77.3 | 112.39,77.3 116.2,77.3
  Bottom 0.838: D204.A 22.86,91.27 v22.86,94.45
  Bottom 1.016: 116.2,86.19 116.2,88.1 114.93,89.37 v114.93,94.45
  Bottom 1.24: 201.93,4.92 201.93,23.96 201.93,30.32 201.93,49.37 204.47,49.37 207.64,52.54 207.64,86.83
  Bottom 1.27: C502.- I502.3 57.78,142.71 | C503.- I503.3 62.86,142.71 | C501.- I501.3 52.7,142.71 | C507.- I507.3 83.18,142.71 | C506.- I506.3 78.1,142.71 | C505.- I505.3 73.02,142.71 | C504.- I504.3 67.94,142.71 | 52.7,142.71 57.78,142.71 | 57.78,142.71 62.86,142.71 | 62.86,142.71 67.94,142.71 | 67.94,142.71 73.02,142.71 | 73.02,142.71 78.1,142.71 | 78.1,142.71 83.18,142.71 | 83.18,142.71 88.26,142.71 | 88.26,142.71 93.34,142.71 | 93.34,142.71 98.42,142.71 | 98.42,142.71 106.04,142.71 L201.1 | 88.26,142.71 I508.3 C508.- | 80.64,53.18 C304.P$2 C301.P$2 SL301.7 80.64,63.34 78.1,66.51 LPC.11 78.1,73.49 75.56,73.49 LPC.31 | C404.P$2 C401.P$2 SL402.7 IO_CONTROLER.11 166.37,78.57 163.83,78.57 IO_CONTROLER.31 v163.83,85.56 163.83,88.1 163.19,89.37 163.19,91.27 164.46,92.54 C406.P$2 C405.P$2 173.35,92.54 R405.P$1 R406.P$1 R407.P$1 R408.P$1 197.48,91.27 197.48,86.83 207.64,86.83 | C211.P$2 R208.P$1 VR202.A | 43.81,69.05 C212.P$2 | 43.81,69.05 R207.P$1 | 88.9,41.11 IC602.8 IC602.7 IC602.6 | IC601.7 IC601.6 50.16,41.11 v75.56,41.11 88.9,41.11 | C404.P$2 C407.P$2 R404.P$1 168.91,48.09 v170.81,48.09 | 36.82,51.27 36.82,56.35 41.27,56.35 42.54,55.08 47.62,55.08 IC601.7 | 36.82,51.27 C208.- | 93.34,142.71 I509.3 C509.- | 98.42,142.71 I510.3 C510.- | 80.64,53.18 92.7,53.18 C302.P$2 92.7,59.52 | SL401.2 125.73,84.29 123.82,84.29 121.28,81.75 121.28,77.3 112.39,77.3 112.39,62.06 132.71,62.06 132.71,48.09 | 132.71,48.09 132.71,40.48 143.5,40.48 143.5,33.49 153.66,33.49 153.66,26.51 170.81,26.51 v170.81,25.87 | IC601.7 IC601.8 | 47.62,142.71 52.7,142.71 | v47.62,126.2 47.62,142.71 | C211.P$2 33.65,71.59 | v75.56,51.27 80.64,51.27 80.64,53.18
  Bottom 1.27: 132.71,48.09 109.85,48.09 109.85,43.02 108.58,41.74 108.58,41.11 88.9,41.11 | C404.P$2 178.43,54.45 C402.P$2 178.43,59.52 | 21.59,43.02 v22.22,39.2 | v47.62,119.85 47.62,84.92 46.98,84.92 46.35,84.29 32.38,84.29 31.75,83.65 29.84,83.65 v28.57,83.02 28.57,78.57 31.75,75.4 31.75,74.77 33.65,74.77 C211.P$2 | v41.9,151.28 41.9,147.16 47.62,142.71 | VR202.A VR201.A | v210.81,4.92 201.93,4.92 194.31,4.92 C410.- | 182.24,4.28 176.53,4.28 | 176.53,4.28 176.53,8.88 | 182.24,4.28 182.24,3.01 176.53,3.01 | 182.24,10.63 176.53,10.63 176.53,8.88 | 157.47,4.28 157.47,10.63 151.12,10.63 151.12,4.28 157.47,4.28 | 176.53,3.01 157.47,3.01 157.47,4.28 | 176.53,4.28 176.53,3.01 | 182.24,10.63 182.24,4.28 | C207.- 35.55,50 36.82,51.27 | 201.93,30.32 189.86,30.32 189.86,20.16 189.22,19.52 189.22,14.44 187.96,13.17 187.96,11.9 IC401.15 182.24,11.9 182.24,10.63 | 201.93,23.96 C412.+ | 176.53,8.88 X401.5 | VR202.A 43.81,69.05 | 178.43,59.52 v174.62,59.52 | 178.43,59.52 C403.P$2 | 92.7,59.52 v88.9,59.52 | 92.7,59.52 C303.P$2
  Bottom 1.676: C202.- 9.52,11.27 8.25,12.54 C201.-
  Bottom 1.905: C203.P$2 10.79,27.14 C204.P$2
  Bottom 1.93: C203.P$2 7.62,18.89 C201.- | 21.59,52.54 21.59,50 21.59,43.02
  Bottom 2.032: C210.P$2 21.59,52.54 IC202.GND 7.62,52.54 7.62,67.14 8.88,68.41 C206.P$2 C205.- | C207.- 21.59,50 | 21.59,43.02 10.79,43.02 IC201.GND 10.79,27.14 | 15.87,83.02 15.87,77.94 D205.K | 15.87,83.02 D206.K D204.A | 15.87,83.02 v20.95,83.02
  Bottom 2.54: C205.- 15.87,77.94 | D204.A D203.A
  pour Bottom (isolate 0.838, no thermals): 43.81,161.76 102.23,161.76 102.23,143.34 107.95,143.34 107.95,138.27 102.23,138.27 102.23,91.27 107.31,91.27 115.56,98.89 215.26,98.89 214.62,0.47 0.63,0.47 0.63,105.88 14.6,105.88 15.23,107.15 15.23,109.69 22.22,116.04 22.22,142.08 33.02,142.08 33.02,145.89 40,145.89 40,152.87 43.81,152.87
GNDI
  Bottom 1.27: X101.4 X101.5 50.06,148.53 50.16,147.79 I501.2 52.7,145.25 57.78,145.25 | 57.78,145.25 I502.2 | 57.78,145.25 62.86,145.25 | 62.86,145.25 67.94,145.25 | 67.94,145.25 73.02,145.25 | 73.02,145.25 78.1,145.25 | 78.1,145.25 83.18,145.25 | 83.18,145.25 88.26,145.25 | 88.26,145.25 93.34,145.25 | 93.34,145.25 98.42,145.25 I510.2 | 88.26,145.25 I508.2 | 83.18,145.25 I507.2 | 73.02,145.25 I505.2 | 78.1,145.25 I506.2 | 62.86,145.25 I503.2 | 67.94,145.25 I504.2 | 93.34,145.25 I509.2
I0
  Bottom 1.27: X101.6 55.24,157.95 R504.P$1
I1
  Bottom 1.27: R505.P$1 60.5,152.87 X102.1
I2
  Bottom 1.27: R506.P$1 65.4,157.85 X102.2
I3
  Bottom 1.27: R510.P$1 70.48,157.95 X102.3
I4
  Bottom 1.27: X102.4 75.54,152.9 R511.P$1
I5
  Bottom 1.27: X102.5 80.54,152.97 R512.P$1
I6
  Bottom 1.27: X102.6 85.54,153.05 R516.P$1
I7
  Bottom 1.27: R517.P$1 90.8,151.42 X103.1
I8
  Bottom 1.27: R518.P$1 95.88,157.85 X103.2
I9
  Bottom 1.27: R520.P$1 100.96,151.58 X103.3
IN_PUT0  (via drill 0.79 pad 2.18)
  Top 0.381: v55.24,127.47 v55.24,132.55
  Bottom 1.016: LPC.22 98.42,115.4 99.06,116.04 99.06,124.93 95.25,124.93 93.34,126.83 93.34,127.47 v55.24,127.47
  Bottom 1.27: I501.4 C501.+ v55.24,132.55 R501.P$1
IN_PUT1  (via drill 0.8 pad 2.03)
  Top 0.381: v60.32,124.93 v60.32,132.55
  Bottom 1.016: v60.32,124.93 60.95,125.56 92.07,125.56 94.61,123.02 97.15,123.02 97.15,116.67 95.88,115.4 LPC.23
  Bottom 1.27: I502.4 C502.+ v60.32,132.55 R502.P$1
IN_PUT2  (via drill 0.79 pad 2.03, 0.8 pad 2.03)
  Top 0.381: v65.4,123.02 v65.4,132.55
  Bottom 1.016: LPC.24 93.34,115.4 95.25,117.31 95.25,121.12 93.98,121.12 91.44,123.66 66.67,123.66 v65.4,123.02
  Bottom 1.27: I503.4 C503.+ v65.4,132.55 R503.P$1
IN_PUT3  (via drill 0.8 pad 2.03)
  Top 0.305: v70.48,121.12 v70.48,132.55
  Bottom 1.016: LPC.25 90.8,116.04 91.44,116.04 93.34,117.94 93.34,119.21 90.8,121.75 70.48,121.75 v70.48,121.12
  Bottom 1.27: I504.4 C504.+ v70.48,132.55 R507.P$1
IN_PUT4  (via drill 0.8 pad 2.03)
  Top 0.381: v75.56,117.31 v75.56,132.55
  Bottom 1.016: v75.56,117.31 76.2,117.94 88.26,117.94 LPC.26
  Bottom 1.27: I505.4 C505.+ v75.56,132.55 R508.P$1
IN_PUT5  (via drill 0.79 pad 2.18, 0.8 pad 2.03)
  Top 0.381: v80.64,113.5 v80.64,132.55
  Bottom 1.016: v80.64,113.5 83.81,113.5 85.09,112.23 85.72,112.23 LPC.27
  Bottom 1.27: I506.4 C506.+ v80.64,132.55 R509.P$1
IN_PUT6  (via drill 0.79 pad 2.18, 0.8 pad 2.03)
  Top 0.381: v85.72,115.4 v85.72,132.55
  Bottom 1.016: LPC.28 83.18,110.96 80.01,110.96 78.1,112.86 78.1,114.13 80.01,116.04 85.09,116.04 v85.72,115.4
  Bottom 1.27: I507.4 C507.+ v85.72,132.55 R513.P$1
IN_PUT7  (via drill 0.8 pad 2.03)
  Top 0.381: v90.8,118.58 v90.8,132.55
  Bottom 1.016: LPC.29 80.64,109.05 79.37,109.05 76.2,112.23 76.2,114.77 74.93,114.77 73.02,116.67 73.02,117.94 74.93,119.85 90.17,119.85 90.8,119.21 v90.8,118.58
  Bottom 1.27: I508.4 C508.+ v90.8,132.55 R514.P$1
IN_PUT8  (via drill 0.79 pad 2.03)
  Top 0.381: v95.88,127.47 v95.88,132.55
  Bottom 1.016: v95.88,127.47 100.96,127.47 100.96,115.4 100.33,114.77 100.33,86.19
  Bottom 1.27: I509.4 C509.+ v95.88,132.55 R515.P$1 | 100.33,86.19 106.04,86.19 106.04,72.86 95.88,72.86 LPC.18
IN_PUT9
  Bottom 1.016: 100.96,132.55 100.96,130.01 102.87,130.01 102.87,114.77 102.23,114.13 102.23,88.1
  Bottom 1.27: I510.4 C510.+ 100.96,132.55 R519.P$1 | LPC.19 98.42,70.95 107.95,70.95 107.95,88.1 102.23,88.1
ISP1_RESET
  Bottom 1.27: LPC.9 73.02,66.51 75.56,63.34 SL301.5 C301.P$1 R301.P$1
ISP2_MISO
  Bottom 1.27: SL402.3 IO_CONTROLER.7
ISP2_MOSI
  Bottom 1.27: SL402.2 IO_CONTROLER.6
ISP2_RESET
  Bottom 1.27: IO_CONTROLER.9 SL402.5 C401.P$1 R401.P$1
ISP2_SCK
  Bottom 1.27: SL402.4 IO_CONTROLER.8
ISP2_SS
  Bottom 1.27: SL402.1 IO_CONTROLER.5
KB_INT
  Bottom 1.27: D405.C D406.C D407.C D408.C 155.57,54.45 158.11,51.91 158.11,51.27 | 158.11,51.27 158.11,45.55 173.35,45.55 173.35,51.91 | 158.11,51.27 C407.P$1 | 173.35,51.91 181.61,51.91 IO_CONTROLER.17 | 173.35,51.91 171.44,51.91 R404.P$2
L
  Bottom 2.54: X101.1 20.95,157.95 F201.1
LPC_EXT_INT  (via drill 0.81 pad 2.18)
  Top 0.381: v90.8,72.86 v114.93,72.86 | v175.89,27.78 v175.89,47.46
  Bottom 1.27: LPC.16 v90.8,72.86 | IO_CONTROLER.18 184.15,50 175.89,50 v175.89,47.46 | v175.89,27.78 175.89,28.41 156.21,28.41 156.21,36.03 146.05,36.03 146.05,43.02 136.52,43.02 135.25,44.29 135.25,69.05 125.09,69.05 125.09,66.51 116.2,66.51 116.2,72.86 v114.93,72.86
LPC_READY  (via drill 0.81 pad 2.18)
  Top 0.381: v93.34,70.95 v120.65,70.95
  Bottom 1.27: LPC.17 v93.34,70.95 | IO_CONTROLER.33 158.75,76.67 132.08,76.67 132.08,77.94 130.17,77.94 130.17,79.21 128.9,80.48 126.36,80.48 125.09,79.21 125.09,73.49 120.65,73.49 v120.65,70.95
LPC_RXD  (via drill 0.81 pad 2.18)
  Top 0.381: v101.59,77.94 v127.63,77.94 | v163.83,72.86 v171.44,72.86
  Bottom 1.27: v171.44,72.86 176.53,72.86 IO_CONTROLER.15 | v163.83,72.86 127,72.86 127,77.3 v127.63,77.94 | LPC.14 85.72,77.94 v101.59,77.94
LPC_TXD  (via drill 0.81 pad 2.18)
  Top 0.381: v103.5,75.4 v129.53,75.4 | v163.83,76.03 v168.91,76.03
  Bottom 1.27: IO_CONTROLER.14 173.99,70.32 168.91,70.32 v168.91,76.03 | v163.83,76.03 161.92,74.77 130.81,74.77 v129.53,75.4 | LPC.15 88.26,75.4 v103.5,75.4
N
  Bottom 2.54: TR201.6 17.14,117.31 17.14,147.16 27.94,147.16 27.94,150.97 34.92,150.97 34.92,157.85 X101.2 X101.3
N$1
  Bottom 2.54: F201.2 5.71,135.72 TR201.1
N$2
  Bottom 2.54: D203.C D201.A 43.81,105.24 37.26,105.24 TR201.8
N$3
  Bottom 1.27: R201.P$1 R207.P$2 43.81,74.38 VR201.R
N$4
  Bottom 1.27: IC401.3 198.12,14.44 C408.-
N$5
  Bottom 2.54: 37.46,130.65 TR201.11 37.46,130.72 | 37.46,130.65 26.03,130.65 26.03,106.52 14.6,106.52 12.69,104.61 3.17,104.61 D202.A D204.C | 37.46,130.65 37.46,130.72 | 37.46,130.72 37.46,135.72
N$6
  Bottom 1.27: LPC.12 80.64,66.51 83.18,63.34 83.18,57.11 Q301.1 90.17,57.11 C302.P$1
N$7
  Bottom 1.27: VR202.R 38.09,66.51 R208.P$2 R203.P$1
N$8
  Bottom 1.27: LPC.13 83.18,66.51 85.72,63.34 Q301.2 90.17,61.94 C303.P$1
N$9
  Bottom 1.27: IC401.1 C408.+
N$10
  Bottom 1.27: IO_CONTROLER.12 168.91,60.16 Q401.1 171.44,56.98 C402.P$1
N$11
  Bottom 1.27: IO_CONTROLER.13 Q401.2 171.44,62.06 C403.P$1
N$12
  Bottom 1.27: IC401.5 C411.-
N$13
  Bottom 1.27: IC401.4 C411.+
N$14
  Bottom 1.27: IC401.2 190.5,11.9 190.5,8.73 189.22,8.73 189.22,3.65 C409.+
N$15
  Bottom 1.27: SL403.1 D401.C
N$16
  Bottom 1.27: SL403.2 D402.C
N$17
  Bottom 1.27: SL403.3 D403.C
N$18
  Bottom 1.27: SL403.4 D404.C
N$19
  Bottom 1.27: IC401.6 195.58,22.06 195.58,26.51 C412.-
N$20
  Bottom 1.27: D205.A R205.P$1
N$21  (via drill 0.81 pad 5.08)
  other vias: 212.09,38.57
N$22
  Bottom 1.27: D501.C R504.P$2
N$23
  Bottom 1.27: I501.1 D501.A
N$26
  Bottom 1.27: D504.C R510.P$2
N$27
  Bottom 1.27: I504.1 D504.A
N$28
  Bottom 1.27: D507.C R516.P$2
N$29
  Bottom 1.27: I507.1 D507.A
N$30
  Bottom 1.27: D510.C R520.P$2
N$31
  Bottom 1.27: I510.1 D510.A
N$32
  Bottom 1.016: 106.04,128.11 IC701.3 | IC701.1 107.95,133.19 106.04,131.28 106.04,128.11 | R701.P$2 107.95,119.21 106.04,121.12 106.04,128.11
N$33
  Bottom 1.27: C701.P$1 R701.P$1 R707.P$2 IC701.5
N$34
  Bottom 1.27: D206.A R206.P$1
N$36
  Bottom 1.27: D508.C R517.P$2
N$37
  Bottom 1.27: I508.1 D508.A
N$38  (via drill 0.81 pad 3.81)
  other vias: 4.44,166.84
N$39
  Bottom 1.27: D505.C R511.P$2
N$40
  Bottom 1.27: I505.1 D505.A
N$41  (via drill 0.81 pad 5.08)
  other vias: 166.37,38.57
N$42
  Bottom 1.016: R702.P$2 119.38,119.21 119.38,128.11 | 122.55,128.11 IC702.3 119.38,128.11 | 119.38,128.11 119.38,131.28 121.28,133.19 IC702.1
N$43
  Bottom 1.27: D502.C R505.P$2
N$44
  Bottom 1.27: I502.1 D502.A
N$45
  Bottom 1.27: D509.C R518.P$2
N$46
  Bottom 1.27: I509.1 D509.A
N$47
  Bottom 1.27: D506.C R512.P$2
N$48
  Bottom 1.27: I506.1 D506.A
N$49
  Bottom 1.27: C702.P$1 R702.P$1 R708.P$2 IC702.5
N$50  (via drill 0.81 pad 3.81)
  other vias: 23.49,166.84
N$51
  Bottom 1.27: D503.C R506.P$2
N$52
  Bottom 1.27: I503.1 D503.A
N$53  (via drill 0.81 pad 3.81)
  other vias: 23.49,-4.61
N$54  (via drill 0.81 pad 3.81)
  other vias: 210.81,166.84
N$55
  Bottom 1.016: R703.P$2 132.71,119.21 132.71,127.47 | 132.71,127.47 132.71,128.11 | 132.71,128.11 IC703.3 133.34,128.11 132.71,127.47 | 132.71,128.11 132.71,131.28 135.25,133.82 IC703.1
N$56
  Bottom 1.27: C703.P$1 R703.P$1 R709.P$2 IC703.5
N$57
  Bottom 1.016: IC707.1 187.96,133.19 186.05,131.28 186.05,128.11 | 186.05,128.11 IC707.3 | 186.05,128.11 186.05,119.21 R719.P$2
N$58  (via drill 0.81 pad 3.81)
  other vias: 3.17,3.01
N$59
  Bottom 1.016: 146.05,128.11 IC704.3 | 146.05,128.11 146.05,119.21 R710.P$2 | IC704.1 147.95,133.19 146.05,131.28 146.05,128.11
N$60
  Bottom 1.27: C704.P$1 R710.P$1 R716.P$2 IC704.5
N$61  (via drill 0.81 pad 3.81)
  other vias: 4.44,-4.61
N$62
  Bottom 1.016: IC705.1 161.92,133.82 159.38,131.92 159.38,128.11 | 159.38,128.11 IC705.3 | R711.P$2 159.38,119.21 159.38,128.11
N$63
  Bottom 1.27: C705.P$1 R711.P$1 R717.P$2 IC705.5
N$64  (via drill 0.81 pad 3.81)
  other vias: 186.05,-4.61
N$65  (via drill 0.81 pad 3.81)
  other vias: 186.69,166.84
N$66
  Bottom 1.016: R712.P$2 172.72,119.21 172.72,128.11 | 172.72,128.11 IC706.3 | 172.72,128.11 172.72,131.28 174.62,133.19 IC706.1
N$67  (via drill 0.81 pad 3.81)
  other vias: 12.06,150.65
N$68  (via drill 0.81 pad 3.81)
  other vias: 210.81,-4.61
N$69
  Bottom 1.27: C706.P$1 R712.P$1 R718.P$2 IC706.5
N$72
  Bottom 1.27: C707.P$1 R719.P$1 R723.P$2 IC707.5
N$76
  Bottom 1.016: R720.P$2 199.38,119.21 199.38,128.11 | 199.38,128.11 IC708.3 | 199.38,128.11 199.38,131.28 201.29,133.19 IC708.1
N$77
  Bottom 1.27: IC708.5 R724.P$2 R720.P$1 C708.P$1
OUT_PUT0
  Bottom 1.27: R601.P$1 LPC.1
OUT_PUT1
  Bottom 1.27: R602.P$1 LPC.2
OUT_PUT2
  Bottom 1.27: R603.P$1 LPC.3
OUT_PUT3
  Bottom 1.27: R604.P$1 LPC.4
OUT_PUT4
  Bottom 1.27: LPC.5 R605.P$1 64.13,64.6 65.4,63.34 SL301.1
OUT_PUT5
  Bottom 1.27: LPC.6 65.4,66.51 67.94,63.34 SL301.2 67.94,60.8 65.4,58.26 R606.P$1
OUT_PUT6
  Bottom 1.27: LPC.7 67.94,66.51 70.48,63.34 SL301.3 70.48,60.8 67.94,58.26 R607.P$1
OUT_PUT7
  Bottom 1.27: LPC.8 70.48,66.51 73.02,63.34 SL301.4 73.02,60.8 70.48,58.26 R608.P$1
OUT_PUT8
  Bottom 1.27: R609.P$1 LPC.20
OUT_PUT9
  Bottom 1.016: LPC.21 R610.P$1
Q0
  Bottom 1.27: X105.1 24.76,4.28 24.76,22.7 K601.P1
Q1
  Bottom 1.27: K601.S1 27.94,8.09 31.11,8.09 34.28,4.28 X105.2
Q2
  Bottom 1.27: K602.P1 38.73,20.16 33.02,20.16 33.02,10 38.73,10 38.73,5.55 40,4.94 X105.3
Q3
  Bottom 1.27: K602.S1 41.27,12.54 41.27,7.46 44.45,7.46 44.45,4.28 X105.4
Q3:1
  Bottom 1.27: IO_CONTROLER.28 Q402.1 C405.P$1
Q3:2
  Bottom 1.27: IO_CONTROLER.29 Q402.2 C406.P$1
Q4
  Bottom 1.27: K603.P1 49.52,20.16 43.81,20.16 43.81,10 49.52,10 49.52,4.38 X105.5
Q5
  Bottom 1.27: K603.S1 52.06,12.54 52.06,7.46 55.06,7.46 X105.6
Q6
  Bottom 1.27: K604.P1 60.32,20.16 54.6,20.16 54.6,10 59.68,10 59.68,4.46 X106.1
Q7
  Bottom 1.27: K604.S1 62.22,12.54 62.22,7.46 65.5,7.46 X106.2
Q8
  Bottom 1.27: K605.P1 71.12,20.16 65.4,20.16 65.4,10 70.51,10 X106.3
Q9
  Bottom 1.27: K605.S1 73.66,12.56 73.66,7.46 75.54,7.46 X106.4
Q10
  Bottom 1.27: K606.P1 81.91,20.16 76.2,20.16 76.2,10 80.64,10 80.64,4.28 X106.5
Q11
  Bottom 1.27: K606.S1 84.45,12.54 84.45,8.09 85.09,8.09 85.09,4.28 X106.6
Q12
  Bottom 1.27: K607.P1 92.7,20.16 86.99,20.16 86.99,10 90.17,10 90.17,4.28 X107.1
Q13
  Bottom 1.27: K607.S1 92.7,10 95.25,10 95.25,3.65 X107.2
Q14
  Bottom 1.27: K608.P1 103.5,20.16 97.79,20.16 97.79,10 100.96,10 100.96,4.28 X107.3
Q15
  Bottom 1.27: K608.S1 103.5,10 106.02,10 X107.4
Q16
  Bottom 1.27: K609.P1 114.3,20.16 108.58,20.16 108.58,10 111.02,10 X107.5
Q17
  Bottom 1.27: X107.6 116.2,3.65 116.2,12.54 K609.S1
Q18
  Bottom 1.27: K610.P1 125.09,20.16 119.38,20.16 119.38,10 121.28,10 121.28,4.28 X108.1
Q19
  Bottom 1.27: 126.36,4.81 X108.2 126.36,4.28 126.36,4.81 | K610.S1 126.36,12.54 126.36,4.81
R/W
  Bottom 1.27: IO_CONTROLER.35 153.66,78.57 135.25,78.57 135.25,89.37 133.34,89.37 SL401.5
RD0
  Bottom 1.27: IC601.5 R601.P$2
RD1
  Bottom 1.27: IC601.4 R602.P$2
RD2
  Bottom 1.27: IC601.3 R603.P$2
RD3
  Bottom 1.27: IC601.2 R604.P$2
RD4
  Bottom 1.27: IC601.1 R605.P$2
RD5
  Bottom 1.27: IC602.5 96.52,47.46 86.36,47.46 86.36,44.92 65.4,44.92 R606.P$2
RD6
  Bottom 1.27: IC602.4 99.06,49.37 84.45,49.37 84.45,46.83 67.94,46.83 R607.P$2
RD7
  Bottom 1.27: IC602.3 101.59,51.27 82.55,51.27 82.55,48.73 70.48,48.73 R608.P$2
RD8
  Bottom 1.27: IC602.2 104.14,53.18 100.96,53.18 R609.P$2
RD9
  Bottom 1.27: IC602.1 106.68,55.08 103.5,55.08 103.5,69.05 109.85,69.05 109.85,83.02 R610.P$2
RECIVE_FROM_PC
  Bottom 1.27: X401.3 167,16.35 182.24,16.35 182.24,16.98 IC401.13
RELAY0
  Bottom 1.27: IC601.12 52.7,34.76 35.55,34.76 K601.16
RELAY1
  Bottom 1.27: K602.16 46.35,32.86 55.24,32.86 IC601.13
RELAY2
  Bottom 1.27: IC601.14 57.78,30.32 K603.16
RELAY3
  Bottom 1.27: IC601.15 60.32,32.86 67.94,32.86 K604.16
RELAY4
  Bottom 1.27: K605.16 78.73,32.86 69.84,32.86 69.84,34.76 62.86,34.76 IC601.16
RELAY5
  Bottom 1.27: K606.16 89.53,33.49 96.52,33.49 IC602.12
RELAY6
  Bottom 1.27: IC602.13 99.06,30.32 K607.16
RELAY7
  Bottom 1.27: K608.16 111.12,32.86 101.59,32.86 IC602.14
RELAY8
  Bottom 1.27: IC602.15 104.14,34.76 121.92,34.76 K609.16
RELAY9
  Bottom 1.27: IC602.16 111.12,37.3 111.12,41.11 113.66,43.65 117.47,43.65 119.38,41.74 124.45,41.74 130.81,35.4 130.81,30.32 K610.16
ROW0
  Bottom 1.016: 181.61,82.38 IO_CONTROLER.24
  Bottom 1.27: IO_CONTROLER.24 R408.P$2 | 181.61,82.38 181.61,80.48 184.15,80.48 184.15,77.94 199.38,77.94 199.38,57.62 193.67,57.62 193.67,41.11 190.5,37.94 175.89,37.94 175.89,30.32 158.11,30.32 158.11,37.94 147.95,37.94 SL403.5 D405.A
ROW1
  Bottom 1.016: 179.06,82.38 IO_CONTROLER.25
  Bottom 1.27: IO_CONTROLER.25 R407.P$2 | 179.06,82.38 179.06,78.57 182.24,78.57 182.24,76.03 197.48,76.03 197.48,59.52 191.77,59.52 191.77,42.38 189.22,39.84 173.99,39.84 173.99,32.22 160.02,32.22 160.02,39.84 150.49,39.84 SL403.6 D406.A
ROW2
  Bottom 1.016: IO_CONTROLER.26 176.53,78.57
  Bottom 1.27: R406.P$2 IO_CONTROLER.26 176.53,76.67 180.34,76.67 180.34,74.13 195.58,74.13 195.58,61.43 189.86,61.43 189.86,43.65 187.96,41.74 170.81,41.74 170.81,34.12 161.92,34.12 161.92,41.74 153.03,41.74 SL403.7 D407.A
ROW3
  Bottom 1.27: R405.P$2 IO_CONTROLER.27 173.99,74.77 178.43,74.77 178.43,72.22 193.67,72.22 193.67,63.34 187.96,63.34 187.96,44.92 186.69,43.65 155.57,43.65 SL403.8 D408.A
RS  (via drill 0.91 pad 2.18)
  Top 0.381: v132.71,80.48 v156.21,80.48
  Bottom 1.016: v156.21,80.48 IO_CONTROLER.34
  Bottom 1.27: SL401.4 130.81,81.75 132.08,80.48 v132.71,80.48
RXD_FROM_PC  (via drill 0.91 pad 2.18)
  Top 0.381: v182.88,47.46 v182.88,31.59
  Bottom 1.27: IO_CONTROLER.16 179.06,70.32 191.77,70.32 191.77,65.24 186.05,65.24 186.05,47.46 v182.88,47.46 | v182.88,31.59 182.88,19.52 IC401.12
SCL
  Bottom 1.27: IO_CONTROLER.22 186.69,79.84 201.29,79.84 201.29,55.72 195.58,55.72 195.58,39.84 191.77,36.03 178.43,36.03 178.43,20.79 136.52,20.79 R402.P$1 136.52,15.08 130.17,15.08 130.17,10 131.44,10 X108.3
SDA
  Bottom 1.27: IO_CONTROLER.23 184.15,86.83 193.67,86.83 193.67,81.75 203.19,81.75 203.19,54.45 202.56,53.81 197.48,53.81 197.48,38.57 193.03,34.12 180.34,34.12 180.34,18.25 R403.P$1 139.69,13.17 135.25,13.17 135.22,4.25 X108.4
SEND_TO_PC  (via drill 0.81 pad 2.18)
  Top 0.381: v164.46,13.81 v169.54,13.81
  Bottom 1.27: X401.2 164.46,9.11 v164.46,13.81 | v169.54,13.81 169.54,14.44 IC401.14
TXD_TO_PC  (via drill 0.91 pad 2.18)
  Top 0.381: v196.21,84.29 v191.13,84.29
  Bottom 1.27: v191.13,84.29 IO_CONTROLER.21 | IC401.11 187.96,22.06 187.96,32.22 194.31,32.22 199.38,37.3 199.38,51.91 203.83,51.91 205.1,53.18 205.1,84.29 v196.21,84.29
(copper drawn outside any net)
  shapes: Bottom area x2

## Text on the board
Top: AVR-LPC v.0.0.0 | 11.05.2010
Bottom: AVR-LPC v.0.0.0 | 11.05.2010